# EAGLE design SaV64_v133_oops (EAGLE 7.3.2)
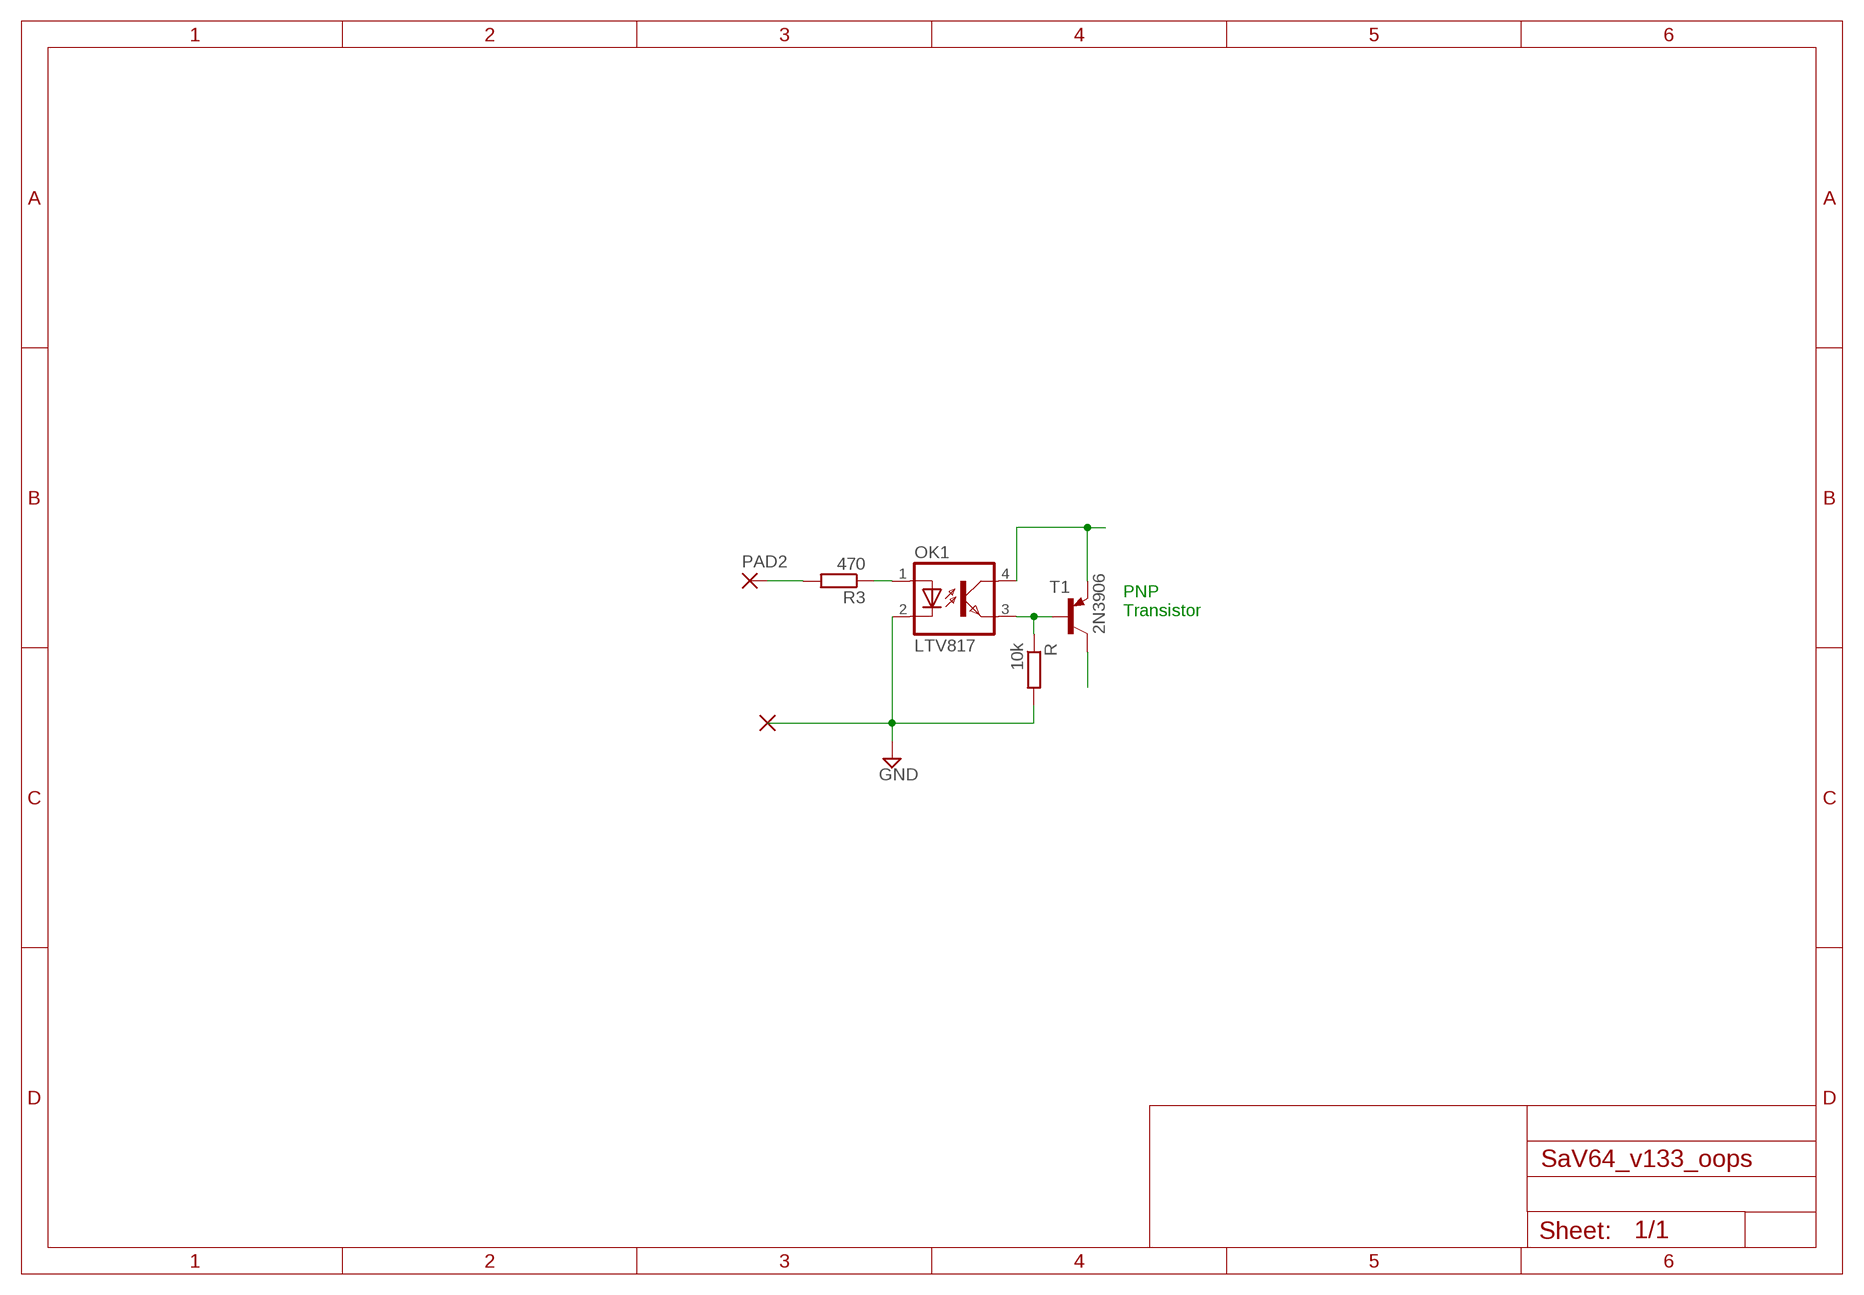
[diagram p0: schematic, sheet 1]

## Parts
OK1  LTV817  LTV816S  [SMD4]
PAD2  1,6/0,8  [1,6/0,8]
R  10k  R-EU_R1210W  [R1210W]
R3  470  R-EU_R1210W  [R1210W]
T1  2N3906  [TO92]

## Nets
GND: OK1.2(C) R.2
N$1: OK1.1(A) R3.1
N$2: OK1.3(EMIT) R.1 T1.2(B)
N$7: PAD2.1(P) R3.2
N$9: OK1.4(COL) T1.3(E)
N$11: T1.1(C)

## Notes on the sheet
- PNP
  Transistor

## Library data of the parts
OK1 = optocoupler:LTV816: OPTO COUPLER Source: LITEON, LTV816.pdf; OC_FARNELL: unknown; OC_NEWARK: unknown
PAD2 = wirepad:1,6/0,8: THROUGH-HOLE PAD
R R3 = resistor:R-EU_: RESISTOR, European symbol
T1 = transistor-pnp:2N3906: PNP Transistor

## Board
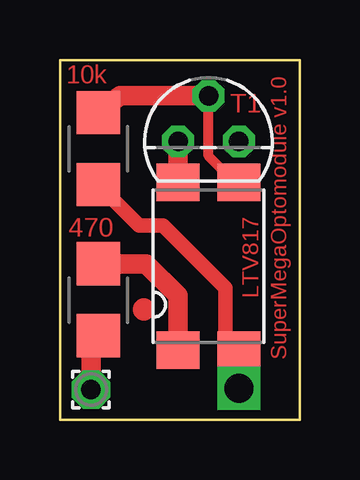
[diagram p1: board, top side]
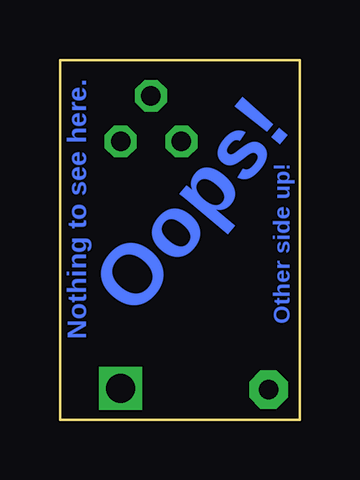
[diagram p2: board, bottom side, seen from below]

Size 10 x 15 mm. Coordinates in mm from the lower left corner, seen from the top.
Outline: 0,0 10,0 10,15 0,15 0,0
Copper layers (1*16): Top 0.035mm / dielectric 1.5mm / Bottom 0.035mm
Design rules "ITEADstudio_DRC": minimum track width 6mil, minimum drill 12mil, track to track 6mil, track to pad 6mil, pad to pad 6mil, via to via 6mil, smd to smd 0mil, copper to edge 10mil, drill to drill 10mil, minimum pad ring 10mil, minimum via ring 6mil, stop-mask expansion 2mil, vias tented up to drill 100mil, thermal gap 10mil

### Footprints (pad centres in the part's own frame; a part is rotated, then mirrored left to right if it is on the bottom)
SMD4 = smd 1.78 x 1.55: 1 -1.27,-3.5; 2 1.27,-3.5; 3 1.27,3.5; 4 -1.27,3.5
1,6/0,8 = drill 0.813 pad 1.6 octagon: 1 0,0
R1210W = smd 1.8 x 1.8: 1 -1.499,0; 2 1.499,0
TO92 = drill 0.813 octagon: 1 1.27,0; 2 0,1.905; 3 -1.27,0

### Placement (x,y rotation side)
OK1  6.2,6.4 0 top
PAD2  1.3,1.25 90 top
R  1.6,11.3 270 top
R3  1.6,5 270 top
T1  6.2,11.6 0 top

### Tracks (layer width: path | path; a pad name or v marks a point on that pad's centre or on a via)
GND  (via drill 1.2)
  Top 0.61: R.2 3.3,8.1 4.3,8.1 6.9,5.5 6.9,3.2 7.4,2.7 | v7.47,1.3 OK1.2
  Top 0.813: 7.4,2.7 OK1.2
N$1
  Top 0.813: OK1.1 4.93,5.17 3.6,6.5 R3.1
N$2
  Top 0.406: OK1.3 7.47,9.73 6.2,11 T1.2
  Top 0.813: R.1 2.51,13.51 T1.2
N$7
  Top 0.813: PAD2.1 1.3,3.3 R3.2
N$9
  Top 0.813: OK1.4 4.93,9.7 T1.3
(copper drawn outside any net)
  shapes: Top circle x1

### Text on the board
Top: SuperMegaOptomodule v1.0 | T1
Bottom: Nothing to see here. | Other side up! | Oops!